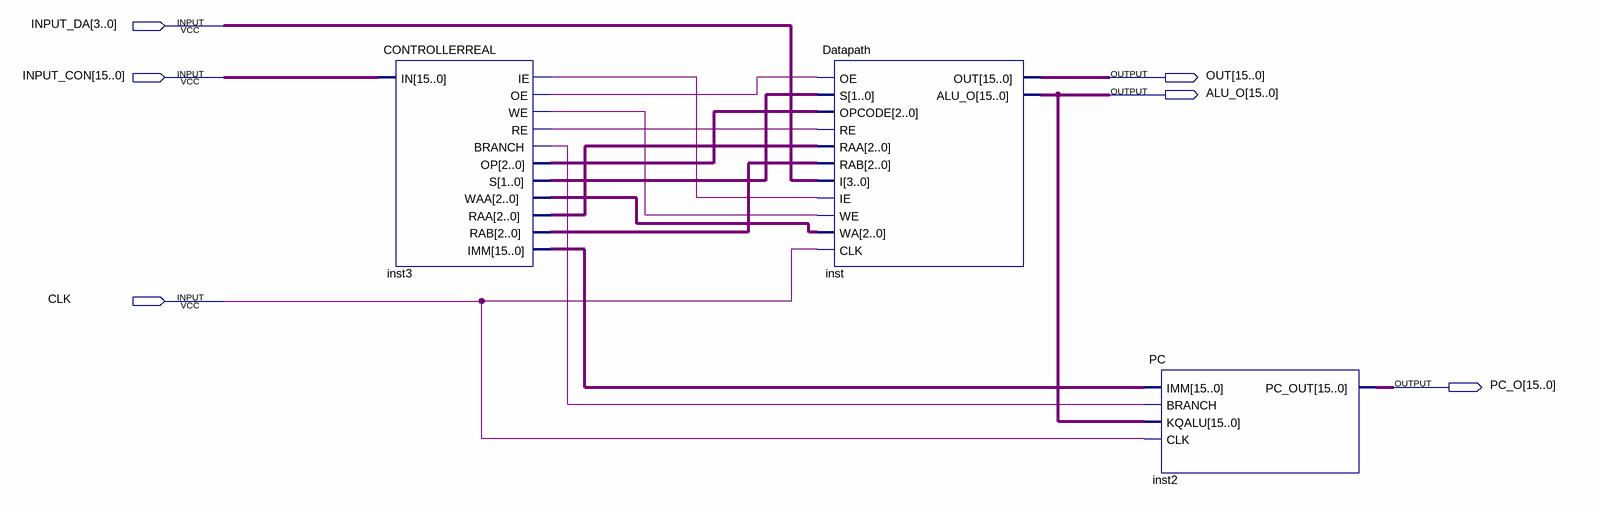
[diagram p0: schematic sheet]
// Quartus schematic PROCESSORREAL.bdf as structural Verilog: 3 symbols, 6 pins
module PROCESSORREAL (
  input  [3:0] INPUT_DA,
  input  [15:0] INPUT_CON,
  input  CLK,
  output [15:0] OUT,
  output [15:0] ALU_O,
  output [15:0] PC_O
);

  wire inst3_branch, inst3_ie, inst3_oe, inst3_re, inst3_we;
  wire [1:0] inst3_s;
  wire [2:0] inst3_op, inst3_raa, inst3_rab, inst3_waa;
  wire [15:0] inst3_imm;

  CONTROLLERREAL inst3 (
    .IN(INPUT_CON), .IE(inst3_ie), .OE(inst3_oe), .WE(inst3_we), .RE(inst3_re), .BRANCH(inst3_branch),
    .OP(inst3_op), .S(inst3_s), .WAA(inst3_waa), .RAA(inst3_raa), .RAB(inst3_rab), .IMM(inst3_imm));
  Datapath inst (
    .OE(inst3_oe), .S(inst3_s), .OPCODE(inst3_op), .RE(inst3_re), .RAA(inst3_raa), .RAB(inst3_rab),
    .I(INPUT_DA), .IE(inst3_ie), .WE(inst3_we), .WA(inst3_waa), .CLK(CLK), .OUT(OUT), .ALU_O(ALU_O));
  PC inst2 (.IMM(inst3_imm), .BRANCH(inst3_branch), .KQALU(ALU_O), .CLK(CLK), .PC_OUT(PC_O));
endmodule
